# EAGLE schematic jr-support_OLD (EAGLE 8.1.0)
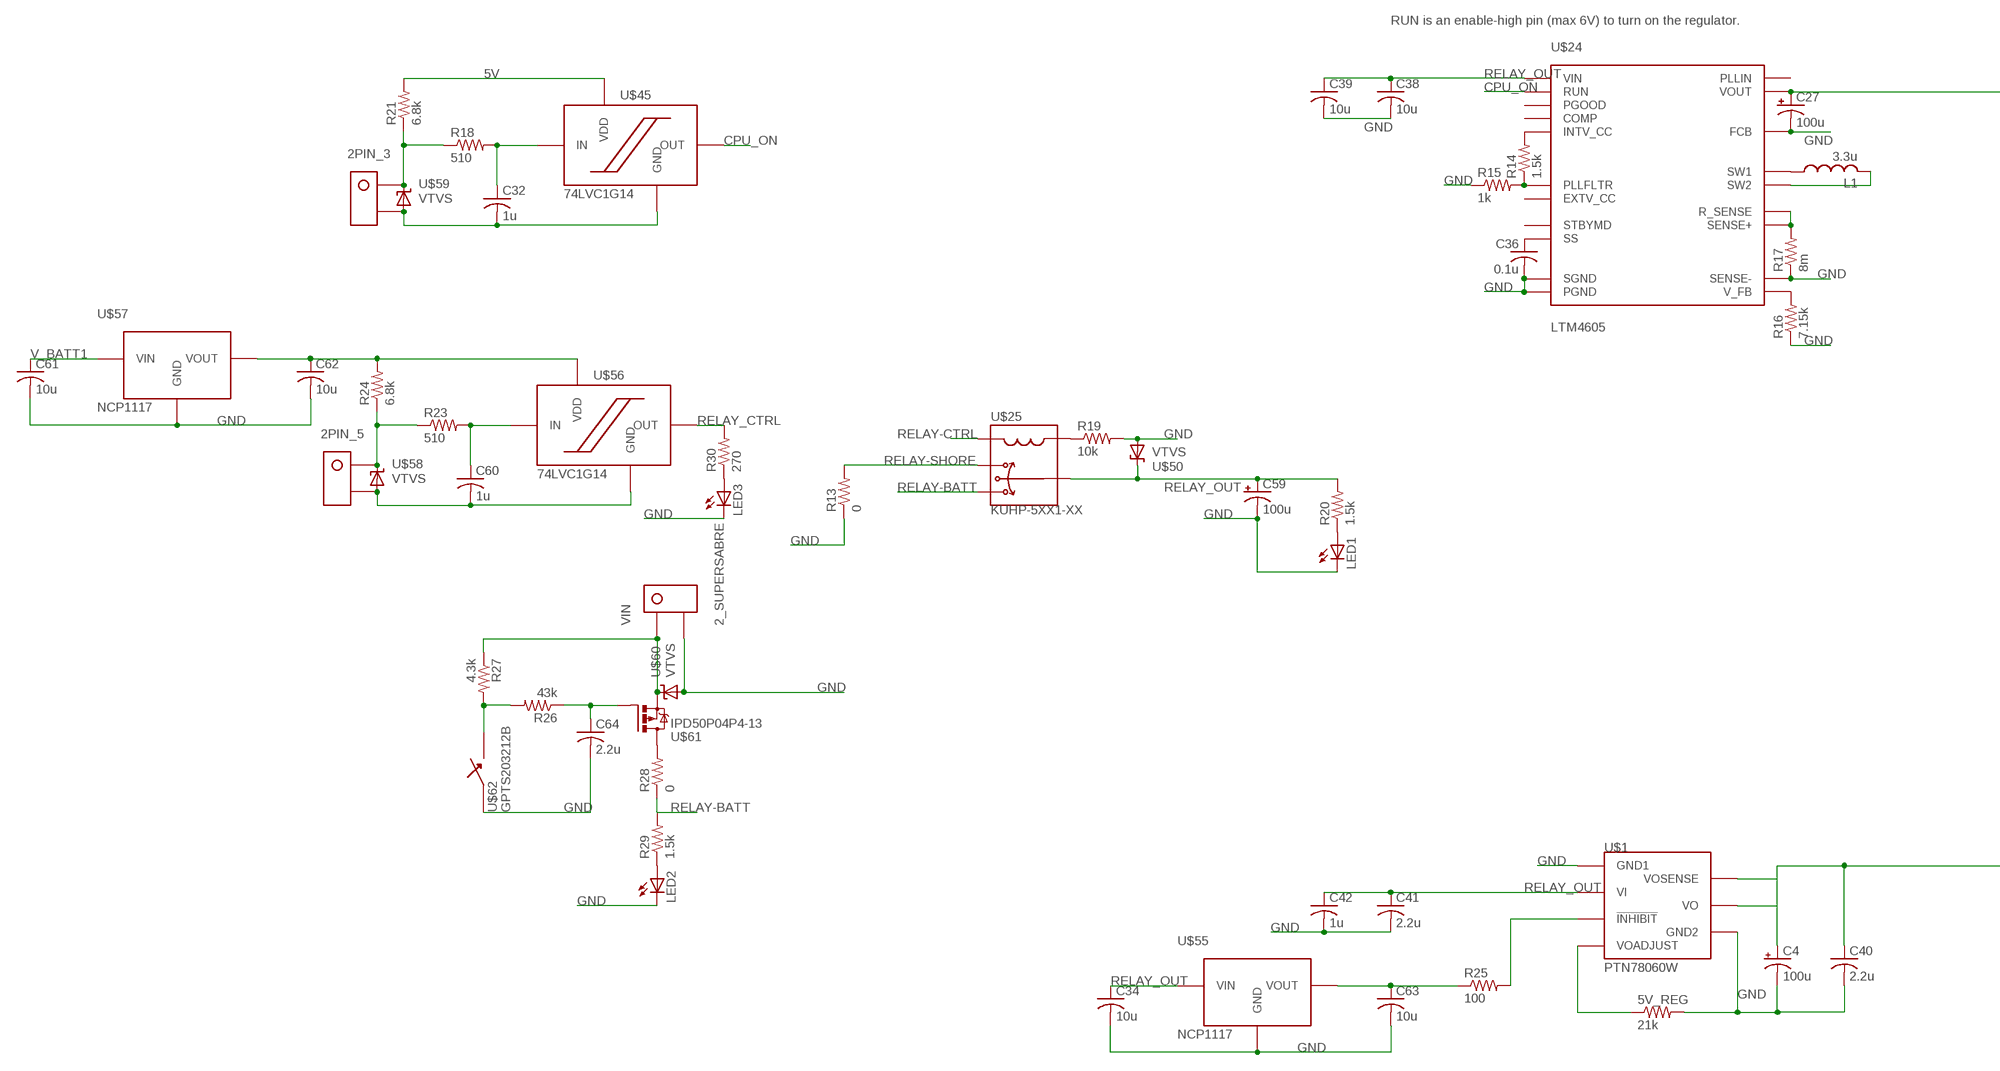
[diagram p0: schematic, sheet 1, part 1 of 2]
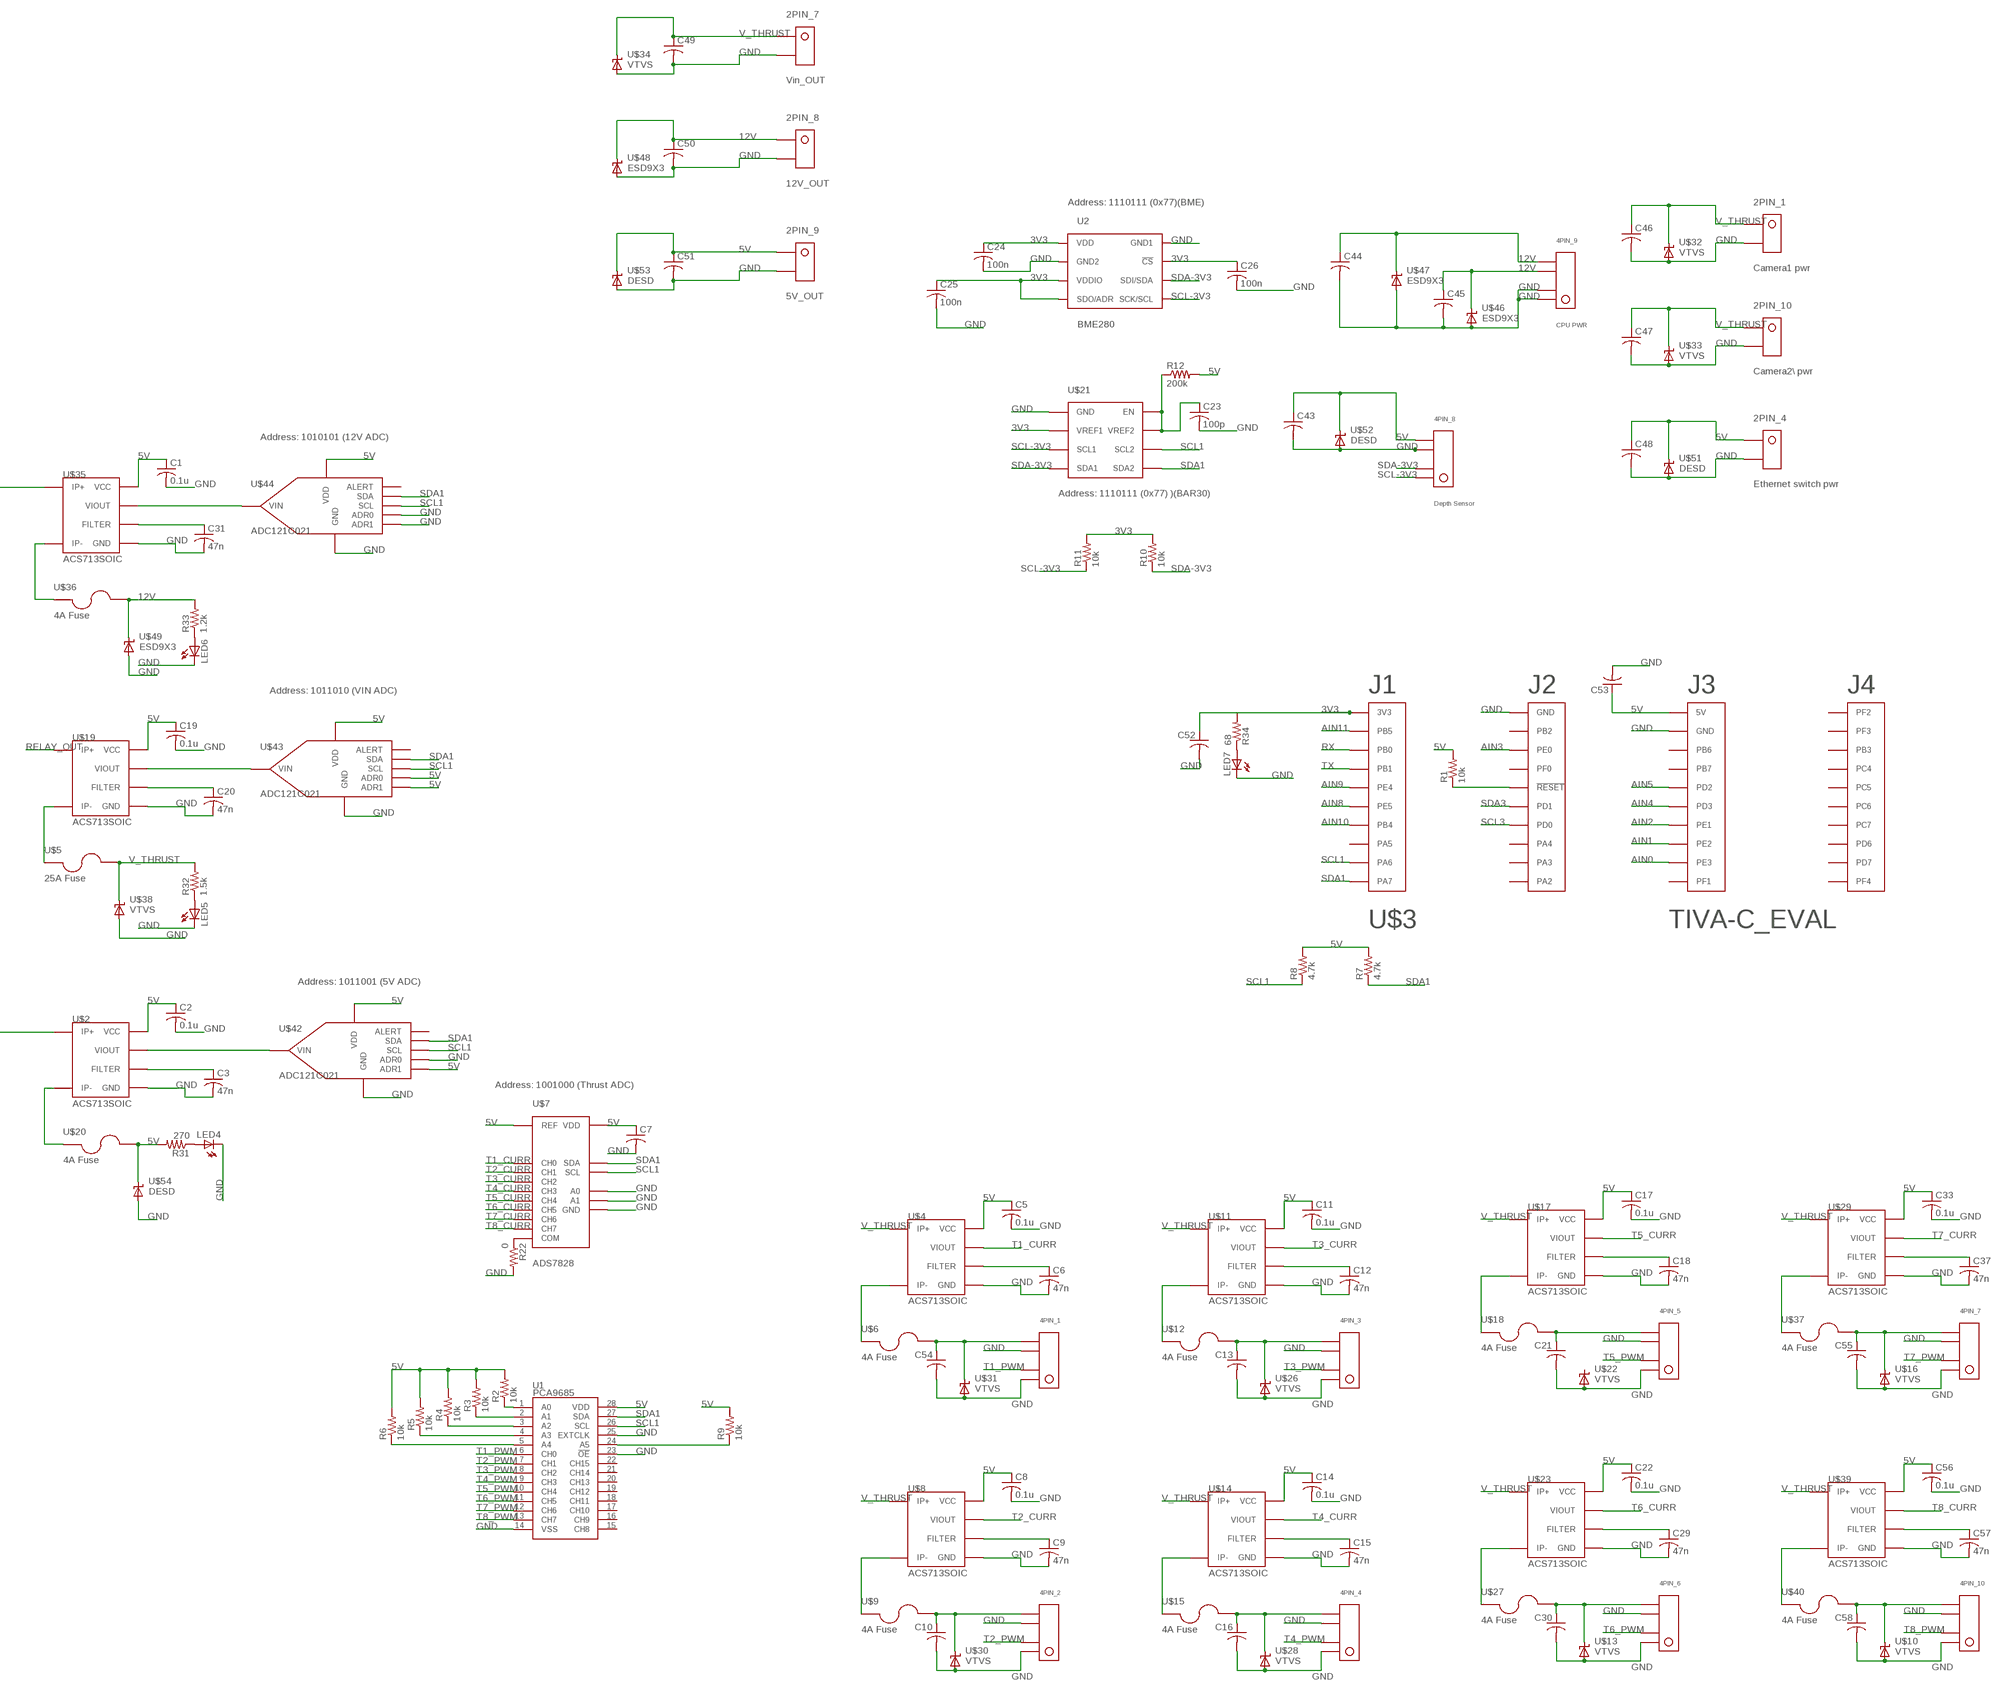
[diagram p1: schematic, sheet 1, part 2 of 2]

## Parts
2PIN_1  Camera1 pwr  KK254_VERT_2PIN22-29-2021  [KK254_VERT_2PIN]
2PIN_3  KK254_VERT_2PIN22-29-2021  [KK254_VERT_2PIN]
2PIN_4  Ethernet switch pwr  KK254_VERT_2PIN22-29-2021  [KK254_VERT_2PIN]
2PIN_5  KK254_VERT_2PIN22-29-2021  [KK254_VERT_2PIN]
2PIN_7  Vin_OUT  KK254_VERT_2PIN22-29-2021  [KK254_VERT_2PIN]
2PIN_8  12V_OUT  KK254_VERT_2PIN22-29-2021  [KK254_VERT_2PIN]
2PIN_9  5V_OUT  KK254_VERT_2PIN22-29-2021  [KK254_VERT_2PIN]
2PIN_10  Camera2\ pwr  KK254_VERT_2PIN22-29-2021  [KK254_VERT_2PIN]
4PIN_1  KK254_VERT_4PIN22-29-2041  [KK254_VERT_4PIN]
4PIN_2  KK254_VERT_4PIN22-29-2041  [KK254_VERT_4PIN]
4PIN_3  KK254_VERT_4PIN22-29-2041  [KK254_VERT_4PIN]
4PIN_4  KK254_VERT_4PIN22-29-2041  [KK254_VERT_4PIN]
4PIN_5  KK254_VERT_4PIN22-29-2041  [KK254_VERT_4PIN]
4PIN_6  KK254_VERT_4PIN22-29-2041  [KK254_VERT_4PIN]
4PIN_7  KK254_VERT_4PIN22-29-2041  [KK254_VERT_4PIN]
4PIN_8  Depth Sensor  KK254_VERT_4PIN22-29-2041  [KK254_VERT_4PIN]
4PIN_9  CPU PWR  KK254_VERT_4PIN22-29-2041  [KK254_VERT_4PIN]
4PIN_10  KK254_VERT_4PIN22-29-2041  [KK254_VERT_4PIN]
5V_REG  21k  R-US_R0805  [R0805]
C1  0.1u  C-USC0805  [C0805]
C2  0.1u  C-USC0805  [C0805]
C3  47n  C-USC0805  [C0805]
C4  100u  CPOL-USF  [PANASONIC_F]
C5  0.1u  C-USC0805  [C0805]
C6  47n  C-USC0805  [C0805]
C7  C-USC0805  [C0805]
C8  0.1u  C-USC0805  [C0805]
C9  47n  C-USC0805  [C0805]
C10  C-USC0805  [C0805]
C11  0.1u  C-USC0805  [C0805]
C12  47n  C-USC0805  [C0805]
C13  C-USC0805  [C0805]
C14  0.1u  C-USC0805  [C0805]
C15  47n  C-USC0805  [C0805]
C16  C-USC0805  [C0805]
C17  0.1u  C-USC0805  [C0805]
C18  47n  C-USC0805  [C0805]
C19  0.1u  C-USC0805  [C0805]
C20  47n  C-USC0805  [C0805]
C21  C-USC0805  [C0805]
C22  0.1u  C-USC0805  [C0805]
C23  100p  C-USC0805  [C0805]
C24  100n  C-USC0805  [C0805]
C25  100n  C-USC0805  [C0805]
C26  100n  C-USC0805  [C0805]
C27  100u  CPOL-USE3.5-8  [E3,5-8]
C29  47n  C-USC0805  [C0805]
C30  C-USC0805  [C0805]
C31  47n  C-USC0805  [C0805]
C32  1u  C-USC0805  [C0805]
C33  0.1u  C-USC0805  [C0805]
C34  10u  C-USC0805  [C0805]
C36  0.1u  C-USC0805  [C0805]
C37  47n  C-USC0805  [C0805]
C38  10u  C-USC0805  [C0805]
C39  10u  C-USC0805  [C0805]
C40  2.2u  C-USC0805  [C0805]
C41  2.2u  C-USC0805  [C0805]
C42  1u  C-USC0805  [C0805]
C43  C-USC0805  [C0805]
C44  C-USC0805  [C0805]
C45  C-USC0805  [C0805]
C46  C-USC0805  [C0805]
C47  C-USC0805  [C0805]
C48  C-USC0805  [C0805]
C49  C-USC0805  [C0805]
C50  C-USC0805  [C0805]
C51  C-USC0805  [C0805]
C52  C-USC0805  [C0805]
C53  C-USC0805  [C0805]
C54  C-USC0805  [C0805]
C55  C-USC0805  [C0805]
C56  0.1u  C-USC0805  [C0805]
C57  47n  C-USC0805  [C0805]
C58  C-USC0805  [C0805]
C59  100u  CPOL-USE3.5-8  [E3,5-8]
C60  1u  C-USC0805  [C0805]
C61  10u  C-USC0805  [C0805]
C62  10u  C-USC0805  [C0805]
C63  10u  C-USC0805  [C0805]
C64  2.2u  C-USC0805  [C0805]
L1  3.3u  L-USHCMA0703  [HCMA0703]
LED1  0805_LED  [0805]
LED2  0805_LED  [0805]
LED3  0805_LED  [0805]
LED4  0805_LED  [0805]
LED5  0805_LED  [0805]
LED6  0805_LED  [0805]
LED7  0805_LED  [0805]
R1  10k  R-US_R0805  [R0805]
R2  10k  R-US_R0805  [R0805]
R3  10k  R-US_R0805  [R0805]
R4  10k  R-US_R0805  [R0805]
R5  10k  R-US_R0805  [R0805]
R6  10k  R-US_R0805  [R0805]
R7  4.7k  R-US_R0805  [R0805]
R8  4.7k  R-US_R0805  [R0805]
R9  10k  R-US_R0805  [R0805]
R10  10k  R-US_R0805  [R0805]
R11  10k  R-US_R0805  [R0805]
R12  200k  R-US_R0805  [R0805]
R13  0  R-US_R0805  [R0805]
R14  1.5k  R-US_R0805  [R0805]
R15  1k  R-US_R0805  [R0805]
R16  7.15k  R-US_R0805  [R0805]
R17  8m  R-US_R0805  [R0805]
R18  510  R-US_R0805  [R0805]
R19  10k  R-US_R0805  [R0805]
R20  1.5k  R-US_R0805  [R0805]
R21  6.8k  R-US_R0805  [R0805]
R22  0  R-US_R0805  [R0805]
R23  510  R-US_R0805  [R0805]
R24  6.8k  R-US_R0805  [R0805]
R25  100  R-US_R0805  [R0805]
R26  43k  R-US_R0805  [R0805]
R27  4.3k  R-US_R0805  [R0805]
R28  0  R-US_R0805  [R0805]
R29  1.5k  R-US_R0805  [R0805]
R30  270  R-US_R0805  [R0805]
R31  270  R-US_R0805  [R0805]
R32  1.5k  R-US_R0805  [R0805]
R33  1.2k  R-US_R0805  [R0805]
R34  68  R-US_R0805  [R0805]
U1  PCA9685  [TSSOP-28_4MM]
U2  BME280  [BME280_LGA]
U$1  PTN78060W  [PTN78060W]
U$2  ACS713SOIC  [ACS713-SOIC]
U$3  TIVA-C_EVAL  [TIVA-C_EVAL]
U$4  ACS713SOIC  [ACS713-SOIC]
U$5  25A Fuse  BOWED-1.25"-FUSECLIPS  [1.25"_FUSECLIPS]
U$6  4A Fuse  154-OMNI_BLOK  [154-OMNI-BLOK]
U$7  ADS7828  [TSSOP16]
U$8  ACS713SOIC  [ACS713-SOIC]
U$9  4A Fuse  154-OMNI_BLOK  [154-OMNI-BLOK]
U$10  VTVS  [DO-219AB]
U$11  ACS713SOIC  [ACS713-SOIC]
U$12  4A Fuse  154-OMNI_BLOK  [154-OMNI-BLOK]
U$13  VTVS  [DO-219AB]
U$14  ACS713SOIC  [ACS713-SOIC]
U$15  4A Fuse  154-OMNI_BLOK  [154-OMNI-BLOK]
U$16  VTVS  [DO-219AB]
U$17  ACS713SOIC  [ACS713-SOIC]
U$18  4A Fuse  154-OMNI_BLOK  [154-OMNI-BLOK]
U$19  ACS713SOIC  [ACS713-SOIC]
U$20  4A Fuse  154-OMNI_BLOK  [154-OMNI-BLOK]
U$21  PCA9306DCT  [SM8]
U$22  VTVS  [DO-219AB]
U$23  ACS713SOIC  [ACS713-SOIC]
U$24  LTM4605  [LGA-141]
U$25  KUHP-5XX1-XX  [KUHP_6.35MM-QUICK-CONNECT]
U$26  VTVS  [DO-219AB]
U$27  4A Fuse  154-OMNI_BLOK  [154-OMNI-BLOK]
U$28  VTVS  [DO-219AB]
U$29  ACS713SOIC  [ACS713-SOIC]
U$30  VTVS  [DO-219AB]
U$31  VTVS  [DO-219AB]
U$32  VTVS  [DO-219AB]
U$33  VTVS  [DO-219AB]
U$34  VTVS  [DO-219AB]
U$35  ACS713SOIC  [ACS713-SOIC]
U$36  4A Fuse  154-OMNI_BLOK  [154-OMNI-BLOK]
U$37  4A Fuse  154-OMNI_BLOK  [154-OMNI-BLOK]
U$38  VTVS  [DO-219AB]
U$39  ACS713SOIC  [ACS713-SOIC]
U$40  4A Fuse  154-OMNI_BLOK  [154-OMNI-BLOK]
U$42  ADC121C021  [VSSOP-8]
U$43  ADC121C021  [VSSOP-8]
U$44  ADC121C021  [VSSOP-8]
U$45  74LVC1G14  [TSSOP5]
U$46  ESD9X3  [SOD-923_SMD]
U$47  ESD9X3  [SOD-923_SMD]
U$48  ESD9X3  [SOD-923_SMD]
U$49  ESD9X3  [SOD-923_SMD]
U$50  VTVS  [DO-219AB]
U$51  DESD  [X1-DFN1006-2]
U$52  DESD  [X1-DFN1006-2]
U$53  DESD  [X1-DFN1006-2]
U$54  DESD  [X1-DFN1006-2]
U$55  NCP1117  [SOT-223]
U$56  74LVC1G14  [TSSOP5]
U$57  NCP1117  [SOT-223]
U$58  VTVS  [DO-219AB]
U$59  VTVS  [DO-219AB]
U$60  VTVS  [DO-219AB]
U$61  IPD50P04P4-13  [TO252-3]
U$62  GPTS203212B  [GPTS203211B]
VIN  2_SUPERSABRE  [SUPERSABRE_2CIRCUIT]

## Nets
3V3: C24.1 C25.1 C26.1 C52.1 R10.2 R11.2 U2.P$2(!CS) U2.P$5(SDO/ADR) U2.P$6(VDDIO) U2.P$8(VDD) U$3.1-1(3V3) U$21.P$2(VREF1)
5V: 2PIN_4.P$1 2PIN_9.P$1 4PIN_8.P$4 C1.1 C2.1 C5.1 C7.1 C8.1 C11.1 C14.1 C17.1 C19.1 C22.1 C33.1 C43.1 C48.1 C51.1 C53.1 C56.1 R1.2 R2.2 R3.2 R4.2 R5.2 R6.2 R7.2 R8.2 R9.2 R12.2 R21.2 U1.28(VDD) U$2.P$8(VCC) U$3.3-1(5V) U$4.P$8(VCC) U$7.10(REF) U$7.16(VDD) U$8.P$8(VCC) U$11.P$8(VCC) U$14.P$8(VCC) U$17.P$8(VCC) U$19.P$8(VCC) U$20.P$2 U$23.P$8(VCC) U$29.P$8(VCC) U$35.P$8(VCC) U$39.P$8(VCC) U$42.P$5(VDD) U$42.P$6(ADR1) U$43.P$3(ADR0) U$43.P$5(VDD) U$43.P$6(ADR1) U$44.P$5(VDD) U$45.P$5(VDD) U$51.P$2(C) U$52.P$2(C) U$53.P$2(C) U$54.P$2(C)
5V-OUT: U$1.P$5(VO)
12V: 2PIN_8.P$1 4PIN_9.P$3 4PIN_9.P$4 C44.1 C45.1 C50.1 R33.2 U$36.P$2 U$46.P$1(C) U$47.P$1(C) U$48.P$1(C) U$49.P$1(C)
AIN0: U$3.3-9(PE3)
AIN1: U$3.3-8(PE2)
AIN2: U$3.3-7(PE1)
AIN3: U$3.2-3(PE0)
AIN4: U$3.3-6(PD3)
AIN5: U$3.3-5(PD2)
AIN8: U$3.1-6(PE5)
AIN9: U$3.1-5(PE4)
AIN10: U$3.1-7(PB4)
AIN11: U$3.1-2(PB5)
CPU_ON: U$24.A8(RUN) U$45.P$4(OUT)
GND: 2PIN_1.P$2 2PIN_4.P$2 2PIN_7.P$2 2PIN_8.P$2 2PIN_9.P$2 2PIN_10.P$2 4PIN_1.P$1 4PIN_1.P$3 4PIN_2.P$1 4PIN_2.P$3 4PIN_3.P$1 4PIN_3.P$3 4PIN_4.P$1 4PIN_4.P$3 4PIN_5.P$1 4PIN_5.P$3 4PIN_6.P$1 4PIN_6.P$3 4PIN_7.P$1 4PIN_7.P$3 4PIN_8.P$3 4PIN_9.P$1 4PIN_9.P$2 4PIN_10.P$1 4PIN_10.P$3 5V_REG.2 C1.2 C2.2 C3.2 C4.- C5.2 C6.2 C7.2 C8.2 C9.2 C10.2 C11.2 C12.2 C13.2 C14.2 C15.2 C16.2 C17.2 C18.2 C19.2 C20.2 C21.2 C22.2 C23.2 C24.2 C25.2 C26.2 C27.- C29.2 C30.2 C31.2 C33.2 C34.2 C36.2 C37.2 C38.2 C39.2 C40.2 C41.2 C42.2 C43.2 C44.2 C45.2 C46.2 C47.2 C48.2 C49.2 C50.2 C51.2 C52.2 C53.2 C54.2 C55.2 C56.2 C57.2 C58.2 C59.- C61.2 C62.2 C63.2 C64.2 LED1.P$2(C) LED2.P$2(C) LED3.P$2(C) LED4.P$2(C) LED5.P$2(C) LED6.P$2(C) LED7.P$2(C) R13.1 R15.1 R16.1 R17.1 R19.2 R22.2 U1.14(VSS) U1.23(!OE) U1.25(EXTCLK) U2.P$1(GND1) U2.P$7(GND2) U$1.P$1(GND1) U$1.P$2(GND2) U$2.P$5(GND) U$3.2-1(GND) U$3.3-2(GND) U$4.P$5(GND) U$7.9(GND) U$7.12(A0) U$7.13(A1) U$8.P$5(GND) U$10.P$1(A) U$11.P$5(GND) U$13.P$1(A) U$14.P$5(GND) U$16.P$1(A) U$17.P$5(GND) U$19.P$5(GND) U$21.P$1(GND) U$22.P$1(A) U$23.P$5(GND) U$24.A1(PGND) U$24.A2(PGND) U$24.A3(PGND) U$24.A5(SENSE-) U$24.A7(SGND) U$24.A9(FCB) U$24.A11(PGND) U$24.A12(PGND) U$24.B1(PGND) U$24.B2(PGND) U$24.B3(PGND) U$24.B4(PGND) U$24.B10(PGND) U$24.B11(PGND) U$24.B12(PGND) U$24.C1(PGND) U$24.C2(PGND) U$24.C3(PGND) U$24.C4(PGND) U$24.C5(PGND) U$24.C6(PGND) U$24.C7(PGND) U$24.C8(PGND) U$24.C9(PGND) U$24.C10(PGND) U$24.C11(PGND) U$24.C12(PGND) U$24.D1(PGND) U$24.D2(PGND) U$24.D3(PGND) U$24.D4(PGND) U$24.D5(PGND) U$24.D6(PGND) U$24.D7(PGND) U$24.D8(PGND) U$24.D9(PGND) U$24.D10(PGND) U$24.D11(PGND) U$24.D12(PGND) U$24.E3(PGND) U$24.E4(PGND) U$24.E5(PGND) U$24.E6(PGND) U$24.E7(PGND) U$24.E8(PGND) U$24.E9(PGND) U$24.E10(PGND) U$24.E11(PGND) U$24.E12(PGND) U$26.P$1(A) U$28.P$1(A) U$29.P$5(GND) U$30.P$1(A) U$31.P$1(A) U$32.P$1(A) U$33.P$1(A) U$34.P$1(A) U$35.P$5(GND) U$38.P$1(A) U$39.P$5(GND) U$42.P$3(ADR0) U$42.P$7(GND) U$43.P$7(GND) U$44.P$3(ADR0) U$44.P$6(ADR1) U$44.P$7(GND) U$46.P$2(A) U$47.P$2(A) U$48.P$2(A) U$49.P$2(A) U$50.P$1(A) U$51.P$1(A) U$52.P$1(A) U$53.P$1(A) U$54.P$1(A) U$55.P$1(GND) U$57.P$1(GND) U$60.P$1(A) U$62.P$1 VIN.P$2
N$1: 5V_REG.1 U$1.P$6(VOADJUST)
N$2: R1.1 U$3.2-5(!RESET!)
N$3: R6.1 U1.5(A4)
N$4: R5.1 U1.4(A3)
N$5: R4.1 U1.3(A2)
N$6: R3.1 U1.2(A1)
N$7: U$1.P$7(VOSENSE)
N$8: C4.+ C40.1 U$2.P$1(IP+) U$2.P$2(IP+)
N$9: R2.1 U1.1(A0)
N$10: R9.1 U1.24(A5)
N$11: C3.1 U$2.P$6(FILTER)
N$12: C9.1 U$8.P$6(FILTER)
N$13: C6.1 U$4.P$6(FILTER)
N$14: 4PIN_1.P$4 C54.1 U$6.P$2 U$31.P$2(C)
N$15: U$4.P$3(IP-) U$4.P$4(IP-) U$6.P$1
N$16: 4PIN_2.P$4 C10.1 U$9.P$2 U$30.P$2(C)
N$17: U$8.P$3(IP-) U$8.P$4(IP-) U$9.P$1
N$18: C12.1 U$11.P$6(FILTER)
N$19: 4PIN_3.P$4 C13.1 U$12.P$2 U$26.P$2(C)
N$20: U$11.P$3(IP-) U$11.P$4(IP-) U$12.P$1
N$21: C15.1 U$14.P$6(FILTER)
N$22: 4PIN_4.P$4 C16.1 U$15.P$2 U$28.P$2(C)
N$23: R22.1 U$7.11(COM)
N$24: U$14.P$3(IP-) U$14.P$4(IP-) U$15.P$1
N$25: C18.1 U$17.P$6(FILTER)
N$26: 4PIN_5.P$4 C21.1 U$18.P$2
N$27: U$17.P$3(IP-) U$17.P$4(IP-) U$18.P$1
N$28: C29.1 U$23.P$6(FILTER)
N$29: 4PIN_6.P$4 C30.1 U$13.P$2(C) U$27.P$2
N$30: U$23.P$3(IP-) U$23.P$4(IP-) U$27.P$1
N$31: C37.1 U$29.P$6(FILTER)
N$32: L1.P$1 U$24.J1(SW1) U$24.J2(SW1) U$24.J3(SW1) U$24.J4(SW1) U$24.K1(SW1) U$24.K2(SW1) U$24.K3(SW1) U$24.K4(SW1) U$24.L1(SW1) U$24.L2(SW1) U$24.L3(SW1) U$24.L4(SW1) U$24.M1(SW1) U$24.M2(SW1) U$24.M3(SW1) U$24.M4(SW1)
N$33: C20.1 U$19.P$6(FILTER)
N$34: U$5.P$1 U$5.P$2 U$19.P$3(IP-) U$19.P$4(IP-)
N$35: R19.1 U$25.AA(A) U$25.AB(A)
N$36: 4PIN_7.P$4 C55.1 U$16.P$2(C) U$37.P$2
N$37: U$29.P$3(IP-) U$29.P$4(IP-) U$37.P$1
N$38: C57.1 U$39.P$6(FILTER)
N$39: 4PIN_10.P$4 C58.1 U$10.P$2(C) U$40.P$2
N$40: R14.2 U$24.F5(INTV_CC)
N$41: C23.1 R12.1 U$21.P$7(VREF2) U$21.P$8(EN)
N$42: R14.1 R15.2 U$24.B8(PLLFLTR)
N$43: R16.2 U$24.B6(V_FB)
N$44: R17.2 U$24.A4(SENSE+) U$24.F10(R_SENSE) U$24.F11(R_SENSE) U$24.F12(R_SENSE) U$24.G5(R_SENSE) U$24.G6(R_SENSE) U$24.G7(R_SENSE) U$24.G8(R_SENSE) U$24.G9(R_SENSE) U$24.G10(R_SENSE) U$24.G11(R_SENSE) U$24.G12(R_SENSE) U$24.H5(R_SENSE) U$24.H6(R_SENSE) U$24.H7(R_SENSE) U$24.H8(R_SENSE) U$24.H9(R_SENSE) U$24.H10(R_SENSE) U$24.H11(R_SENSE) U$24.H12(R_SENSE) U$24.J5(R_SENSE) U$24.J6(R_SENSE) U$24.J7(R_SENSE) U$24.K5(R_SENSE) U$24.K6(R_SENSE) U$24.L5(R_SENSE) U$24.L6(R_SENSE) U$24.M5(R_SENSE) U$24.M6(R_SENSE)
N$45: C36.1 U$24.A6(SS)
N$46: L1.P$2 U$24.J8(SW2) U$24.J9(SW2) U$24.K7(SW2) U$24.K8(SW2) U$24.K9(SW2) U$24.L7(SW2) U$24.L8(SW2) U$24.L9(SW2) U$24.M7(SW2) U$24.M8(SW2) U$24.M9(SW2)
N$47: U$39.P$3(IP-) U$39.P$4(IP-) U$40.P$1
N$48: 2PIN_5.P$2 C60.2 U$56.P$3(GND) U$58.P$1(A)
N$49: C60.1 R23.2 U$56.P$2(IN)
N$50: 2PIN_5.P$1 R23.1 R24.1 U$58.P$2(C)
N$51: 2PIN_3.P$2 C32.2 U$45.P$3(GND) U$59.P$1(A)
N$52: C31.1 U$35.P$6(FILTER)
N$53: U$43.P$4(VIN)
N$54: C62.1 R24.2 U$56.P$5(VDD) U$57.P$2(VOUT) U$57.P$4(VOUT)
N$55: U$2.P$3(IP-) U$2.P$4(IP-) U$20.P$1
N$56: U$35.P$3(IP-) U$35.P$4(IP-) U$36.P$1
N$57: U$2.P$7(VIOUT) U$42.P$4(VIN)
N$58: C27.+ U$24.E1(VOUT) U$24.E2(VOUT) U$24.F1(VOUT) U$24.F2(VOUT) U$24.F3(VOUT) U$24.F4(VOUT) U$24.G1(VOUT) U$24.G2(VOUT) U$24.G3(VOUT) U$24.G4(VOUT) U$24.H1(VOUT) U$24.H2(VOUT) U$24.H3(VOUT) U$24.H4(VOUT) U$35.P$1(IP+) U$35.P$2(IP+)
N$59: C32.1 R18.2 U$45.P$2(IN)
N$60: U$44.P$4(VIN)
N$61: 2PIN_3.P$1 R18.1 R21.1 U$59.P$2(C)
N$62: C63.1 R25.1 U$55.P$2(VOUT) U$55.P$4(VOUT)
N$63: R25.2 U$1.P$3(!INHIBIT!)
N$64: R27.1 U$60.P$2(C) U$61.TAB(D) VIN.P$1
N$65: C64.1 R26.1 U$61.1(G)
N$66: R26.2 R27.2 U$62.P$2
N$67: R28.2 U$61.3(S)
N$68: LED1.P$1(A) R20.1
N$69: LED2.P$1(A) R29.1
N$70: LED3.P$1(A) R30.1
N$71: LED4.P$1(A) R31.1
N$72: LED5.P$1(A) R32.1
N$73: LED6.P$1(A) R33.1
N$74: LED7.P$1(A) R34.1
RELAY-BATT: R28.1 U$25.5A U$25.5B
RELAY-CTRL: U$25.BA(B) U$25.BB(B)
RELAY-SHORE: R13.2 U$25.2A U$25.2B
RELAY_CTRL: U$56.P$4(OUT)
RELAY_OUT: C34.1 C38.1 C39.1 C41.1 C42.1 C59.+ R20.2 U$1.P$4(VI) U$19.P$1(IP+) U$19.P$2(IP+) U$24.J10(VIN) U$24.J11(VIN) U$24.J12(VIN) U$24.K10(VIN) U$24.K11(VIN) U$24.K12(VIN) U$24.L10(VIN) U$24.L11(VIN) U$24.L12(VIN) U$24.M10(VIN) U$24.M11(VIN) U$24.M12(VIN) U$25.7A U$25.7B U$50.P$2(C) U$55.P$3(VIN)
RX: U$3.1-3(PB0)
SCL1: R8.1 U1.26(SCL) U$3.1-9(PA6) U$7.14(SCL) U$21.P$6(SCL2) U$42.P$1(SCL) U$43.P$1(SCL) U$44.P$1(SCL)
SCL3: U$3.2-7(PD0)
SCL-3V3: 4PIN_8.P$1 R11.1 U2.P$4(SCK/SCL) U$21.P$3(SCL1)
SDA1: R7.1 U1.27(SDA) U$3.1-10(PA7) U$7.15(SDA) U$21.P$5(SDA2) U$42.P$8(SDA) U$43.P$8(SDA) U$44.P$8(SDA)
SDA3: U$3.2-6(PD1)
SDA-3V3: 4PIN_8.P$2 R10.1 U2.P$3(SDI/SDA) U$21.P$4(SDA1)
T1_CURR: U$4.P$7(VIOUT) U$7.1(CH0)
T1_PWM: 4PIN_1.P$2 U1.6(CH0)
T2_CURR: U$7.2(CH1) U$8.P$7(VIOUT)
T2_PWM: 4PIN_2.P$2 U1.7(CH1)
T3_CURR: U$7.3(CH2) U$11.P$7(VIOUT)
T3_PWM: 4PIN_3.P$2 U1.8(CH2)
T4_CURR: U$7.4(CH3) U$14.P$7(VIOUT)
T4_PWM: 4PIN_4.P$2 U1.9(CH3)
T5_CURR: U$7.5(CH4) U$17.P$7(VIOUT)
T5_PWM: 4PIN_5.P$2 U1.10(CH4)
T6_CURR: U$7.6(CH5) U$23.P$7(VIOUT)
T6_PWM: 4PIN_6.P$2 U1.11(CH5)
T7_CURR: U$7.7(CH6) U$29.P$7(VIOUT)
T7_PWM: 4PIN_7.P$2 U1.12(CH6)
T8_CURR: U$7.8(CH7) U$39.P$7(VIOUT)
T8_PWM: 4PIN_10.P$2 U1.13(CH7)
TX: U$3.1-4(PB1)
V_BATT1: C61.1 U$57.P$3(VIN)
V_THRUST: 2PIN_1.P$1 2PIN_7.P$1 2PIN_10.P$1 C46.1 C47.1 C49.1 R32.2 U$4.P$1(IP+) U$4.P$2(IP+) U$5.P$3 U$5.P$4 U$8.P$1(IP+) U$8.P$2(IP+) U$11.P$1(IP+) U$11.P$2(IP+) U$14.P$1(IP+) U$14.P$2(IP+) U$17.P$1(IP+) U$17.P$2(IP+) U$23.P$1(IP+) U$23.P$2(IP+) U$29.P$1(IP+) U$29.P$2(IP+) U$32.P$2(C) U$33.P$2(C) U$34.P$2(C) U$38.P$2(C) U$39.P$1(IP+) U$39.P$2(IP+)
Unconnected: R29.2 R30.2 R31.2 R34.2 U1.15(CH8) U1.16(CH9) U1.17(CH10) U1.18(CH11) U1.19(CH12) U1.20(CH13) U1.21(CH14) U1.22(CH15) U$3.1-8(PA5) U$3.2-2(PB2) U$3.2-4(PF0) U$3.2-8(PA4) U$3.2-9(PA3) U$3.2-10(PA2) U$3.3-3(PB6) U$3.3-4(PB7) U$3.3-10(PF1) U$3.4-1(PF2) U$3.4-2(PF3) U$3.4-3(PB3) U$3.4-4(PC4) U$3.4-5(PC5) U$3.4-6(PC6) U$3.4-7(PC7) U$3.4-8(PD6) U$3.4-9(PD7) U$3.4-10(PF4) U$19.P$7(VIOUT) U$22.P$2(C) U$24.A10(STBYMD) U$24.B5(PGOOD) U$24.B7(COMP) U$24.B9(PLLIN) U$24.F6(EXTV_CC) U$35.P$7(VIOUT) U$42.P$2(ALERT) U$43.P$2(ALERT) U$44.P$2(ALERT)

## Notes on the sheet
- Address: 1110111 (0x77)(BME)
- RUN is an enable-high pin (max 6V) to turn on the regulator. | Address: 1010101 (12V ADC)
- Address: 1110111 (0x77) )(BAR30)
- Address: 1011010 (VIN ADC)
- Address: 1011001 (5V ADC)
- Address: 1001000 (Thrust ADC)

## Library data of the parts
2PIN_1 2PIN_3-2PIN_5 2PIN_7-2PIN_10 = molex:KK254_VERT_2PIN: KK® 254 Wire-to-Board Header, Vertical, with Friction Lock, 2 Circuits, Gold (Au) Plating Part Number: 22-29-2021 http://www.molex.com/molex/products/datasheet.jsp?part=active/0022292021_PCB_HEADERS.xml
4PIN_1-4PIN_10 = molex:KK254_VERT_4PIN: KK® 254 Wire-to-Board Header, Vertical, with Friction Lock, 4 Circuits, Gold (Au) Plating Part Number: 22-29-2041 http://www.molex.com/molex/products/datasheet.jsp?part=active/0022292041_PCB_HEADERS.xml
5V_REG R1-R34 = resistor:R-US_: RESISTOR, American symbol
C1-C3 C5-C26 C29-C34 C36-C58 C60-C64 = resistor:C-US: CAPACITOR, American symbol
C4 C27 C59 = resistor:CPOL-US: POLARIZED CAPACITOR, American symbol
L1 = resistor:L-US: INDUCTOR, American symbol
LED1-LED7 = led:0805_LED: LED, 0805 package. Any variety.
U1 = NXP:PCA9685: 16-channel 12-bit PWM I2C interface Internal Oscillator 40Hz to 1kHz Can be totem pole or open collector 2.3V to 5.5V; PROD_ID: IC-12240
U2 = BME280ComponentLibrary:BME280; PROD_ID: IC-13090
U$1 = texas:PTN78060W
U$2 U$4 U$8 U$11 U$14 U$17 U$19 U$23 U$29 U$35 U$39 = allegro:ACS713
U$3 = texas:TIVA-C_EVAL: Texas Instruments Tiva-C TM4C123G LaunchPad Evaluation Board Part number EK-TM4C123GXL Datasheet <http://www.ti.com/lit/ug/spmu296/spmu296.pdf> Microcontroller <http://www.ti.com/lit/ds/spms376e/spms376e.pdf>
U$5 = littelfuse:BOWED-1.25"-FUSECLIPS: Littelfuse 1.25" fuse clips with bowed leads
U$6 U$9 U$12 U$15 U$18 U$20 U$27 U$36 U$37 U$40 = littelfuse:154-OMNI_BLOK: Littelfuse NANO2 Series 154 Omni-Blok fuseholder Datasheet <http://www.mouser.com/ds/2/240/Littelfuse_Fuse_154_154T_154L_154TL_Datasheet.pdf-309941.pdf>
U$7 = texas:ADS7828: Texas Instruments ADS7828 8-channel 12-bit I2C ADC Datasheet <http://www.ti.com/lit/ds/symlink/ads7828.pdf>
U$10 U$13 U$16 U$22 U$26 U$28 U$30-U$34 U$38 U$50 U$58-U$60 = diode:VTVS: Vishay VTVS5V0ASMF to VTVS63GSMF 400W TVS diodes Datasheet <http://www.mouser.com/ds/2/427/vtvs5v0asmf-1078013.pdf>
U$21 = texas:PCA9306: TI I2C/SMBus Level Shifter Bidirectional 5V <-> 3V3 Datasheet <http://www.ti.com/lit/ds/symlink/pca9306.pdf>
U$24 = linear:LTM4605: Linear LTM4605 High Efficiency Buck-Boost DC/DC µModule Regulator Datasheet <https://cds.linear.com/docs/en/datasheet/4605fd.pdf> 4-5-20V in, 0.8-16V out, 5A boost, 12A buck
U$25 = TE:KUHP-5XX1-XX: TE Connectivity KUHP-Series Relay Panel relays with quick-connect terminals Relay Datasheet <http://www.mouser.com/ds/2/418/NG_DS_1308242_KUHP_0914_KUHP_0914-713261.pdf> IMPORTANT NOTE: This part is designed using female PCB-mount spade terminals. Part: Keystone Electronics 0.25"x0.032" PC quick-fit terminals (Part No. 3528). Datasheet <http://www.mouser.com/ds/2/215/528-745365.pdf>
U$42-U$44 = texas:ADC121C021: ADC121C021 8-pin VSSOP package 1 channel, 12-bit I2C ADC Datasheet <http://www.ti.com/lit/ds/symlink/adc121c021.pdf>
U$45 U$56 = NXP:74LVC1G14: Nexperia 74LVC1G14 Single Schmitt trigger inverter Datasheet <http://www.mouser.com/ds/2/302/74LVC1G14_Q100-839654.pdf>
U$46-U$49 = diode:ESD9X3: ON Semiconductors TVS Diodes ESD9X3.3ST5G Series, SZESD9X3.3ST5G Series Datasheet <http://www.mouser.com/ds/2/308/ESD9X3.3ST5G-D-241605.pdf>
U$51-U$54 = diode:DESD: Diodes Inc. Low Cap. Bidirectional TVS Diodes Datasheet <http://www.mouser.com/ds/2/115/ds31434-219410.pdf>
U$55 U$57 = ONSemi:NCP1117: ON Semiconductor NCP1117 5V 1A Fixed LDO Datasheet <http://www.mouser.com/ds/2/308/NCP1117-D-81326.pdf>
U$61 = transistor-power:IPD50P04P4-13: Infineon IPD50P04P4-13 OptiMOS®-P2 Power-Transistor Datasheet <http://www.mouser.com/ds/2/196/Infineon-IPD50P04P4-13-DS-v01_02-EN-336147.pdf>
U$62 = switches:GPTS203212B: CW Industries Pushbutton SPST switch ON-OFF, 1A, 30VDC Datasheet <http://switches-connectors-custom.cwind.com/Asset/GPTS203211BR2.pdf>
VIN = molex:2_SUPERSABRE: Molex SuperSabre 2-pin vertical header